# Altium schematic sheet ECG_ACCEL_Board.SchDoc
size A4; SheetNumber: 1; SheetTotal: 2
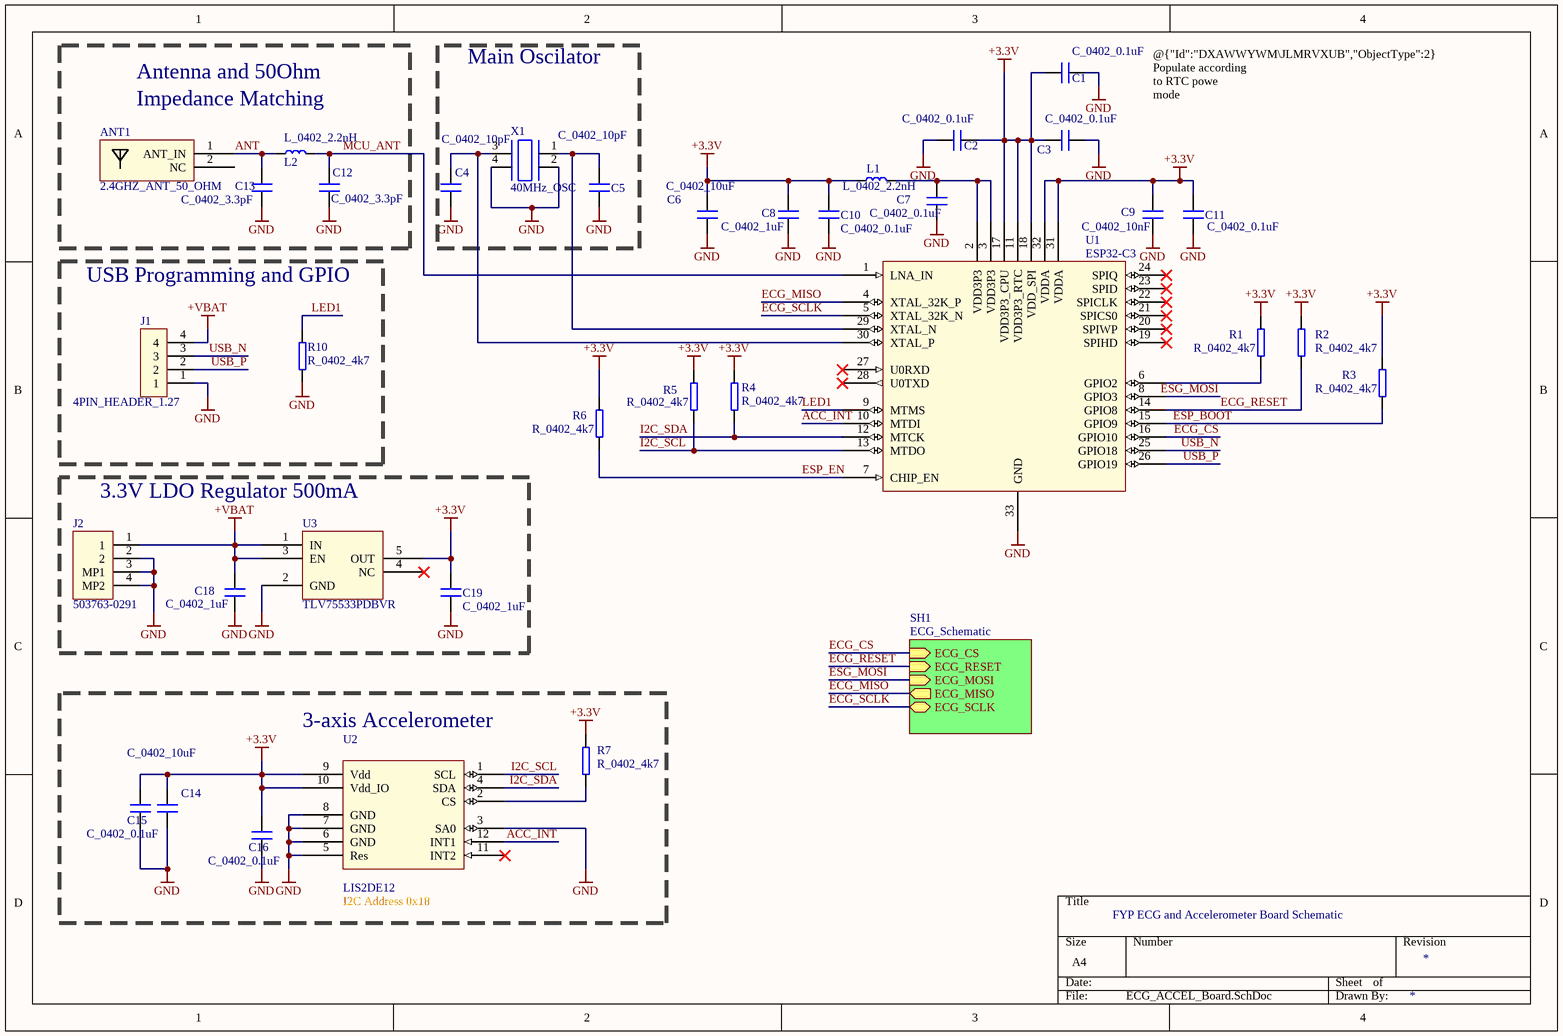
[diagram p0: ECG_ACCEL_Board.SchDoc]

## Parts
ANT1  2.4GHZ_ANT_50_OHM  [Chip2PinSM127P600-8N]
C1  C_0402_0.1uF  [C_0402]
C2  C_0402_0.1uF  [C_0402]
C3  C_0402_0.1uF  [C_0402]
C4  C_0402_10pF  [C_0402]
C5  C_0402_10pF  [C_0402]
C6  C_0402_10uF  [C_0402]
C7  C_0402_0.1uF  [C_0402]
C8  C_0402_1uF  [C_0402]
C9  C_0402_10nF  [C_0402]
C10  C_0402_0.1uF  [C_0402]
C11  C_0402_0.1uF  [C_0402]
C12  C_0402_3.3pF  [C_0402]
C13  C_0402_3.3pF  [C_0402]
C14  C_0402_10uF  [C_0402]
C15  C_0402_0.1uF  [C_0402]
C16  C_0402_0.1uF  [C_0402]
C18  C_0402_1uF  [C_0402]
C19  C_0402_1uF  [C_0402]
J1  4PIN_HEADER_1.27  [4PIN_HEADER_1.27-Footprint-1]
J2  503763-0291  [Molex 503763-0291]
L1  L_0402_2.2nH  [L_0402]
L2  L_0402_2.2nH  [L_0402]
R1  R_0402_4k7  [R_0402]
R2  R_0402_4k7  [R_0402]
R3  R_0402_4k7  [R_0402]
R4  R_0402_4k7  [R_0402]
R5  R_0402_4k7  [R_0402]
R6  R_0402_4k7  [R_0402]
R7  R_0402_4k7  [R_0402]
R10  R_0402_4k7  [R_0402]
U1  ESP32-C3  [QFN127P600-8N]
U2  LIS2DE12  [LIS2DE12-Footprint-1]
U3  TLV75533PDBVR  [SOT95P280X145-5N]
X1  40MHz_OSC  [40MHz_OSC-Footprint-1]

## Blocks framed on the sheet
Main Oscilator: C4 C5 X1
USB Programming and GPIO: J1 R10
3.3V LDO Regulator 500mA: C18 C19 J2 U3
3-axis Accelerometer: C14-C16 R7 U2

## Sub-sheets
SH1 = ECG_Schematic: ECG_CS (in), ECG_RESET (in), ECG_MOSI (in), ECG_MISO (out), ECG_SCLK (bidir)

## Nets
+3.3V: C1.1 C2.2 C3.1 C6.2 C8.2 C9.2 C10.1 C11.2 C14.2 C15.2 C16.2 C19.2 L1.1 R1.1 R2.1 R3.1 R4.1 R5.1 R6.1 R7.1 U1.11(VDD3P3_RTC) U1.17(VDD3P3_CPU) U1.18(VDD_SPI) U1.31(VDDA) U1.32(VDDA) U2.9(Vdd) U2.10(Vdd_IO) U3.5(OUT)
+VBAT: C18.2 J1.4 J2.1 U3.1(IN) U3.3(EN)
GND: C1.2 C2.1 C3.2 C4.1 C5.1 C6.1 C7.2 C8.1 C9.1 C10.2 C11.1 C12.1 C13.1 C14.1 C15.1 C16.1 C18.1 C19.1 J1.1 J2.2 J2.3(MP1) J2.4(MP2) R10.2 U1.33(GND) U2.3(SA0) U2.5(Res) U2.6(GND) U2.7(GND) U2.8(GND) U3.2(GND) X1.2 X1.4
ACC_INT: U1.10(MTDI) U2.12(INT1)
ANT: ANT1.1(ANT_IN) C13.2 L2.1
ECG_CS: U1.16(GPIO10) ; sheet SH1/ECG_CS
ECG_MISO: U1.4(XTAL_32K_P) ; sheet SH1/ECG_MISO
ECG_RESET: R2.2 U1.14(GPIO8) ; sheet SH1/ECG_RESET
ECG_SCLK: U1.5(XTAL_32K_N) ; sheet SH1/ECG_SCLK
ESG_MOSI: U1.8(GPIO3) ; sheet SH1/ECG_MOSI
ESP_BOOT: R3.2 U1.15(GPIO9)
ESP_EN: R6.2 U1.7(CHIP_EN)
I2C_SCL: R5.2 U1.13(MTDO) U2.1(SCL)
I2C_SDA: R4.2 U1.12(MTCK) U2.4(SDA)
LED1: R10.1 U1.9(MTMS)
MCU_ANT: C12.2 L2.2 U1.1(LNA_IN)
USB_N: J1.3 U1.25(GPIO18)
USB_P: J1.2 U1.26(GPIO19)
NetC4_2: C4.2 U1.30(XTAL_P) X1.3
NetC5_2: C5.2 U1.29(XTAL_N) X1.1
NetC7_1: C7.1 L1.2 U1.2(VDD3P3) U1.3(VDD3P3)
NetR1_2: R1.2 U1.6(GPIO2)
NetR7_2: R7.2 U2.2(CS)

Not connected (* = marked no-connect by the designer): ANT1 2(NC); U1 19(SPIHD)* 20(SPIWP)* 21(SPICS0)* 22(SPICLK)* 23(SPID)* 24(SPIQ)* 27(U0RXD)* 28(U0TXD)*; U2 11(INT2)*; U3 4(NC)*

## Notes on the sheet
- Antenna and 50Ohm
- Impedance Matching
- @{"Id":"DXAWWYWM\JLMRVXUB","ObjectType":2}  Populate according to RTC powe mode configurations
- (near U2) I2C Address 0x18
- FYP ECG and Accelerometer Board Schematic

## Library data of the parts
ANT1 = CMP-00009-6: 2.4GHz Chip Antenna 50 Ohm Impedance ANT2012LL00R2400A; Order Code: 603-ANT2012LL00R2400; Distributor: Mouser
C1-C3 C7 C10 C11 C15 C16 = CMP-00055-1: JLC Part Number: C1525
C4 C5 = CMP-00051-1: JLC Part Number: C32949
C6 C14 = CMP-00052-1: JLC Part Number: C15525
C8 C18 C19 = CMP-00053-1: JLC Part Number: C52923
C9 = CMP-00054-1: JLC Part Number: C15195
C12 C13 = CMP-00056-1: JLC Part Number: C326841
J1 = CMP-00049-2: Order Code: 855-M50-3530442; Distributor: Mouser
J2 = CMP-007-000000-2: Molex 503763-0291; Order Code: 538-503763-0291; Design Item ID: 503763-0291; Distributor: Mouser
L1 L2 = CMP-00057-1: JLC Part Number: C92035
R1-R7 R10 = CMP-00050-1: JLC Part Number: C25900
U1 = CMP-00008-4: 33 pin ESP32_C3 Microcontroller; JLC Part Number: C2858491
U2 = CMP-00005-10: Accelerometers MEMS digital output motion sensor: ultra-low-power high-performance 3-axis "femt; Order Code: 511-LIS2DE12TR; JLC Part Number: C155639; Distributor: Mouser
U3 = CMP-00019-2: LDO Voltage Regulators 500-mA high-PSRR low-IQ low-dropout voltage regulator with enable 5-SOT-23 -40 to 125; JLC Part Number: C404027
X1 = CMP-00029-2: 40 MHZ Oscillator, 10pF load capacitance; JLC Part Number: C426988